# EAGLE design mouse_board (EAGLE 8.7.0)
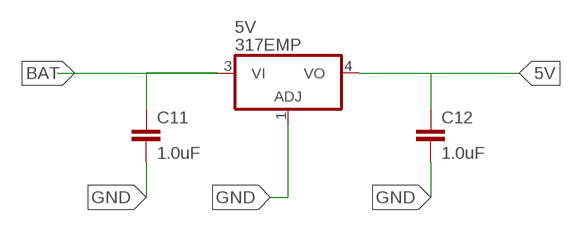
[diagram p0: schematic, sheet 1, part 1 of 2]
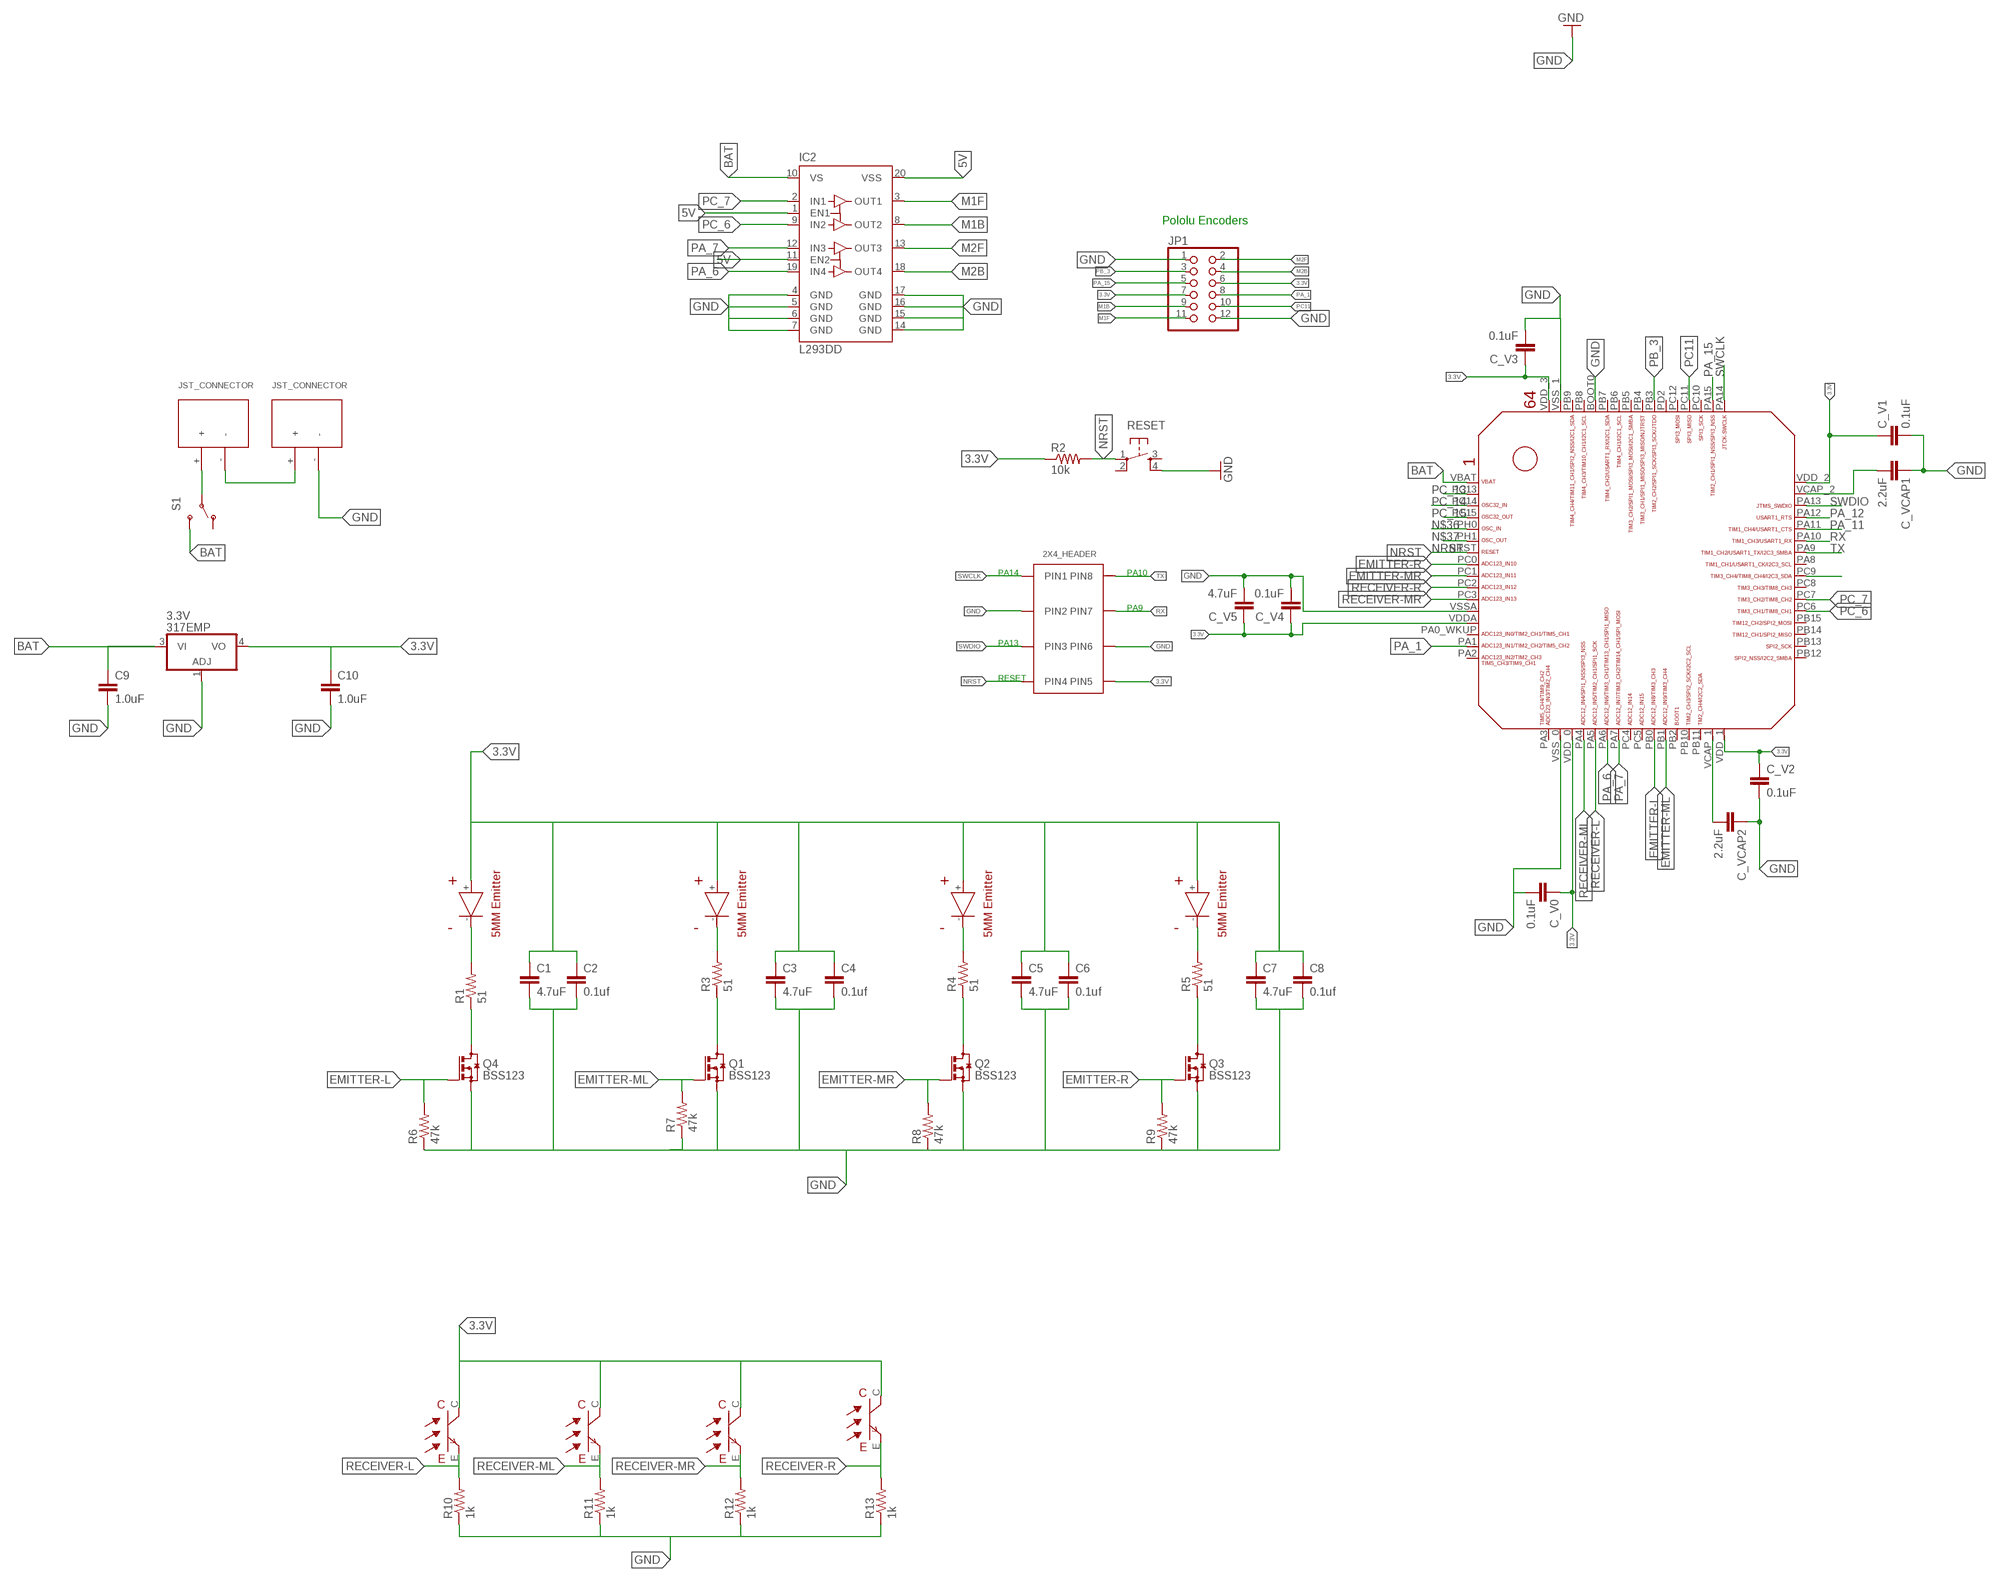
[diagram p1: schematic, sheet 1, part 2 of 2]

## Parts
3.3V  317EMP  [SOT223]
5V  317EMP  [SOT223]
BATTERY1  JST_CONNECTOR_FEMALE  [JST_CONNECTOR_FEMALE]
BATTERY2  JST_CONNECTOR_FEMALE  [JST_CONNECTOR_FEMALE]
C1  4.7uF  CAP0603-CAP  [0603-CAP]
C2  0.1uf  CAP0603-CAP  [0603-CAP]
C3  4.7uF  CAP0603-CAP  [0603-CAP]
C4  0.1uf  CAP0603-CAP  [0603-CAP]
C5  4.7uF  CAP0603-CAP  [0603-CAP]
C6  0.1uf  CAP0603-CAP  [0603-CAP]
C7  4.7uF  CAP0603-CAP  [0603-CAP]
C8  0.1uf  CAP0603-CAP  [0603-CAP]
C9  1.0uF  CAP0603-CAP  [0603-CAP]
C10  1.0uF  CAP0603-CAP  [0603-CAP]
C11  1.0uF  CAP0603-CAP  [0603-CAP]
C12  1.0uF  CAP0603-CAP  [0603-CAP]
C_V0  0.1uF  CAP0603-CAP  [0603-CAP]
C_V1  0.1uF  CAP0603-CAP  [0603-CAP]
C_V2  0.1uF  CAP0603-CAP  [0603-CAP]
C_V3  0.1uF  CAP0603-CAP  [0603-CAP]
C_V4  0.1uF  CAP0603-CAP  [0603-CAP]
C_V5  4.7uF  CAP0603-CAP  [0603-CAP]
C_VCAP1  2.2uF  CAP0603-CAP  [0603-CAP]
C_VCAP2  2.2uF  CAP0603-CAP  [0603-CAP]
IC2  L293DD  [SO20]
JP1  PINHD-2X6  [2X06]
MCU/BLU  2X3_HEADER  [2X3_HEADER]
Q1  BSS123  [SOT23]
Q2  BSS123  [SOT23]
Q3  BSS123  [SOT23]
Q4  BSS123  [SOT23]
R1  51  RESISTOR0603  [0603-RES]
R2  10k  RESISTOR0603  [0603-RES]
R3  51  RESISTOR0603  [0603-RES]
R4  51  RESISTOR0603  [0603-RES]
R5  51  RESISTOR0603  [0603-RES]
R6  47k  RESISTOR0603  [0603-RES]
R7  47k  RESISTOR0603  [0603-RES]
R8  47k  RESISTOR0603  [0603-RES]
R9  47k  RESISTOR0603  [0603-RES]
R10  1k  RESISTOR0603  [0603-RES]
R11  1k  RESISTOR0603  [0603-RES]
R12  1k  RESISTOR0603  [0603-RES]
R13  1k  RESISTOR0603  [0603-RES]
RESET  TAC_SWITCHPTH  [TACTILE-PTH]
S1  SWITCH-SPST-SMD-A  [SWITCH-SPST-SMD-A]
U$1  STM32F405/415_LQFP64  [STM32F405/415_LQFP64]
U$2  EMITTER  [EMITTER]
U$3  EMITTER  [EMITTER]
U$4  EMITTER  [EMITTER]
U$5  EMITTER  [EMITTER]
U$6  RECEIVER  [RECEIVER]
U$7  RECEIVER  [RECEIVER]
U$8  RECEIVER  [RECEIVER]
U$9  RECEIVER  [RECEIVER]

## Nets
3.3V: 3.3V.4(VO) C1.1 C2.1 C7.1 C8.1 C10.1 C_V0.1 C_V1.1 C_V2.1 C_V3.1 C_V4.1 C_V5.1 JP1.6 JP1.7 MCU/BLU.PIN5 R2.1 U$1.VDD_0 U$1.VDD_1 U$1.VDD_2 U$1.VDD_3 U$1.VDDA U$2.+ U$3.+ U$4.+ U$5.+ U$6.C U$7.C U$8.C U$9.C
3.3V1: Q4.3(D) R1.1
3.3V2: Q1.3(D) R3.1
3.3V4: Q3.3(D) R5.1
5V: 5V.4(VO) C12.1 IC2.1(EN1) IC2.11(EN2) IC2.20(VSS)
5V1: C3.1 C4.1
5V2: C5.1 C6.1
BAT: 3.3V.3(VI) 5V.3(VI) C9.1 C11.1 IC2.10(VS) S1.3(S) U$1.VBAT
EMITTER-L: Q4.1(G) R6.2 U$1.PB0
EMITTER-L2: R11.2 U$7.E
EMITTER-L3: R12.2 U$8.E
EMITTER-L4: R13.2 U$9.E
EMITTER-ML: Q1.1(G) R7.2 U$1.PB1
EMITTER-MR: Q2.1(G) R8.2 U$1.PC1
EMITTER-R: Q3.1(G) R9.2 U$1.PC0
GND: 3.3V.1(ADJ) 5V.1(ADJ) BATTERY2.- C1.2 C2.2 C3.2 C4.2 C5.2 C6.2 C7.2 C8.2 C9.2 C10.2 C11.2 C12.2 C_V0.2 C_V1.2 C_V2.2 C_V3.2 C_V4.2 C_V5.2 C_VCAP1.1 C_VCAP2.1 IC2.4(GND) IC2.5(GND) IC2.6(GND) IC2.7(GND) IC2.14(GND) IC2.15(GND) IC2.16(GND) IC2.17(GND) JP1.1 JP1.12 MCU/BLU.PIN2 MCU/BLU.PIN6 Q1.2(S) Q2.2(S) Q3.2(S) Q4.2(S) R6.1 R7.1 R8.1 R9.1 R10.1 R11.1 R12.1 R13.1 RESET.4 U$1.BOOT0 U$1.VSS_0 U$1.VSS_1 U$1.VSSA
M1B: IC2.8(OUT2) JP1.9
M1F: IC2.3(OUT1) JP1.11
M2B: IC2.18(OUT4) JP1.4
M2F: IC2.13(OUT3) JP1.2 U$1.PC9
N$2: R1.2 U$5.-
N$3: R3.2 U$4.-
N$4: R4.2 U$3.-
N$5: R5.2 U$2.-
N$6: Q2.3(D) R4.1
N$8: BATTERY1.- BATTERY2.+
N$9: BATTERY1.+ S1.2(P)
N$36: U$1.PH0
N$37: U$1.PH1
NRST: MCU/BLU.PIN4 R2.2 RESET.1 U$1.NRST
PA_1: JP1.8 U$1.PA1
PA_6: IC2.19(IN4) U$1.PA6
PA_7: IC2.12(IN3) U$1.PA7
PA_11: U$1.PA11
PA_12: U$1.PA12
PA_15: JP1.5 U$1.PA15
PB_3: JP1.3 U$1.PB3
PC11: JP1.10 U$1.PC11
PC_6: IC2.9(IN2) U$1.PC6
PC_7: IC2.2(IN1) U$1.PC7
PC_13: U$1.PC13
PC_14: U$1.PC14
PC_15: U$1.PC15
RECEIVER-L: R10.2 U$1.PA5 U$6.E
RECEIVER-ML: U$1.PA4
RECEIVER-MR: U$1.PC3
RECEIVER-R: U$1.PC2
RX: MCU/BLU.PIN7 U$1.PA10
SWCLK: MCU/BLU.PIN1 U$1.PA14
SWDIO: MCU/BLU.PIN3 U$1.PA13
TX: MCU/BLU.PIN8 U$1.PA9
V_C1: C_VCAP1.2 U$1.VCAP_2
V_C2: C_VCAP2.2 U$1.VCAP_1
Unconnected: RESET.2 RESET.3 S1.1(O) U$1.PA0_WKUP(PA0_AKUP) U$1.PA2 U$1.PA3 U$1.PA8 U$1.PB2 U$1.PB4 U$1.PB5 U$1.PB6 U$1.PB7 U$1.PB8 U$1.PB9 U$1.PB10 U$1.PB11 U$1.PB12 U$1.PB13 U$1.PB14 U$1.PB15 U$1.PC4 U$1.PC5 U$1.PC8 U$1.PC10 U$1.PC12 U$1.PD2

## Notes on the sheet
- Pololu Encoders
- PA14 | PA10
- PA9
- PA13
- RESET

## Library data of the parts
3.3V 5V = linear:*317: Positive VOLTAGE REGULATOR; SPICEPREFIX: J
BATTERY1 BATTERY2 = JST_CONNECTOR_FEMALE. through hole:JST_CONNECTOR_FEMALE
C1-C8 C_V0 C_V1-C_V5 C_VCAP1 C_VCAP2 = SparkFun:CAP: Capacitor Standard 0603 ceramic capacitor, and 0.1" leaded capacitor.
C9-C12 = SparkFun-Capacitors:CAP: Capacitor Standard 0603 ceramic capacitor, and 0.1" leaded capacitor.
IC2 = st-microelectronics:L293DD: PUSH-PULL FOUR CHANNEL DRIVER WITH DIODES Source: http://www.st.com/stonline/books/pdf/docs/1330.pdf; OC_FARNELL: unknown
JP1 = pinhead:PINHD-2X6: PIN HEADER
MCU/BLU = 2X4_HEADER:2X3_HEADER
Q1-Q4 = transistor-small-signal:BSS123: N-CHANNEL MOS FET
R1-R13 = SparkFun-Resistors:RESISTOR: Resistor Basic schematic elements and footprints for 0603, 1206, and PTH resistors.
RESET = SparkFun:TAC_SWITCH: Momentary Switch Button commonly used for reset or general input. Spark Fun Electronics SKU : COM-00097
S1 = SparkFun:SWITCH-SPST: SPST Switch Simple slide switch. Spark Fun Electronics SKU : COM-00102
U$1 = STM32F10x-F4xx:STM32F405/415_LQFP64
U$2-U$5 = sfh4550 _ teft4300:EMITTER
U$6-U$9 = sfh4550 _ teft4300:RECEIVER

## Board
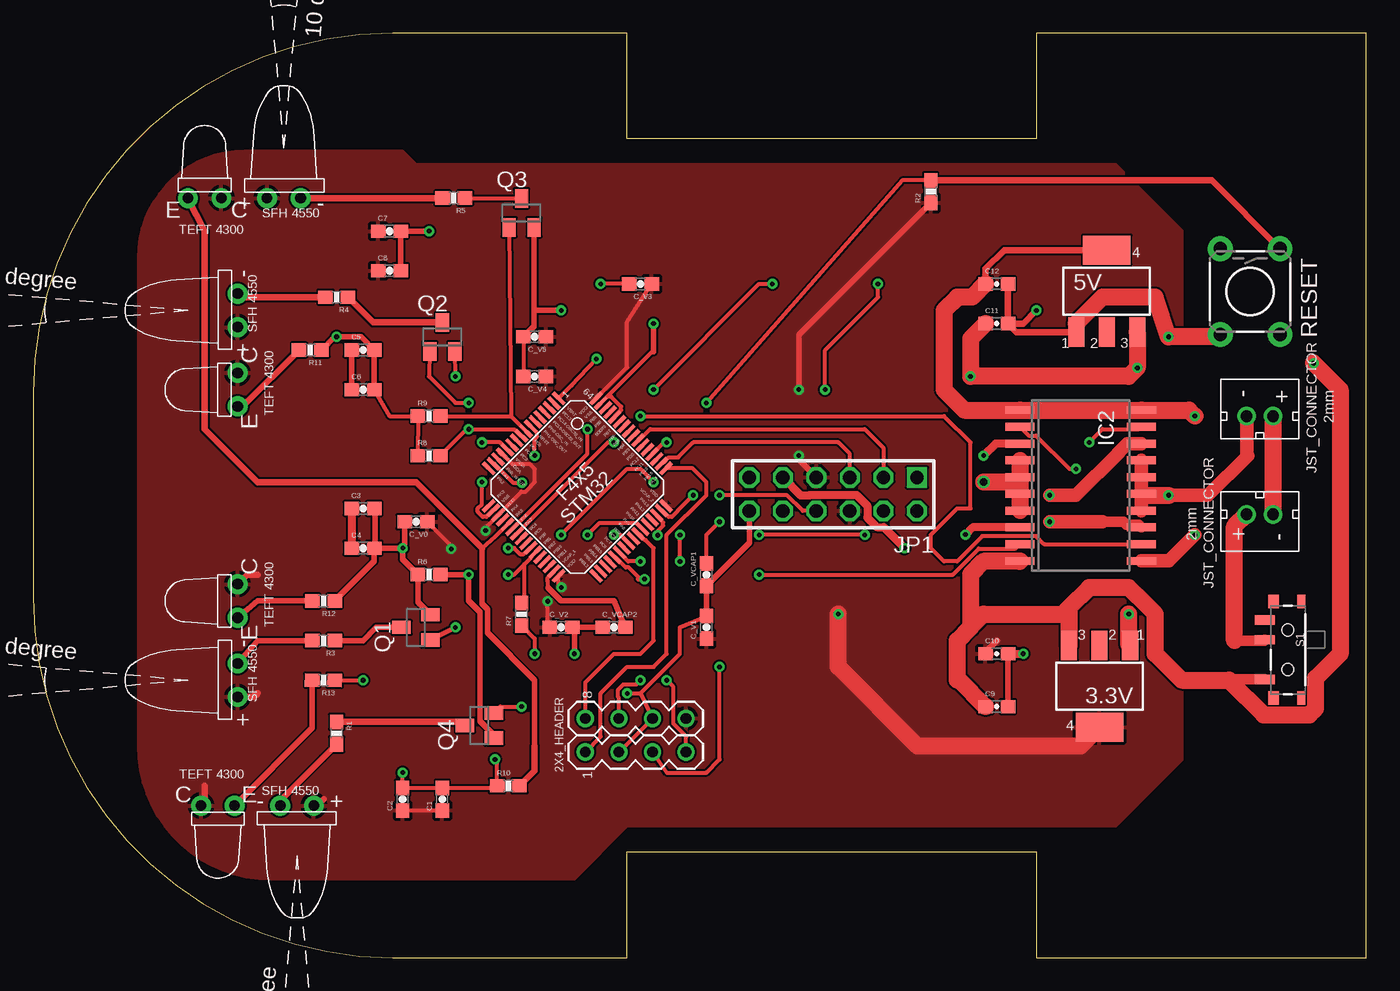
[diagram p2: board, top side]
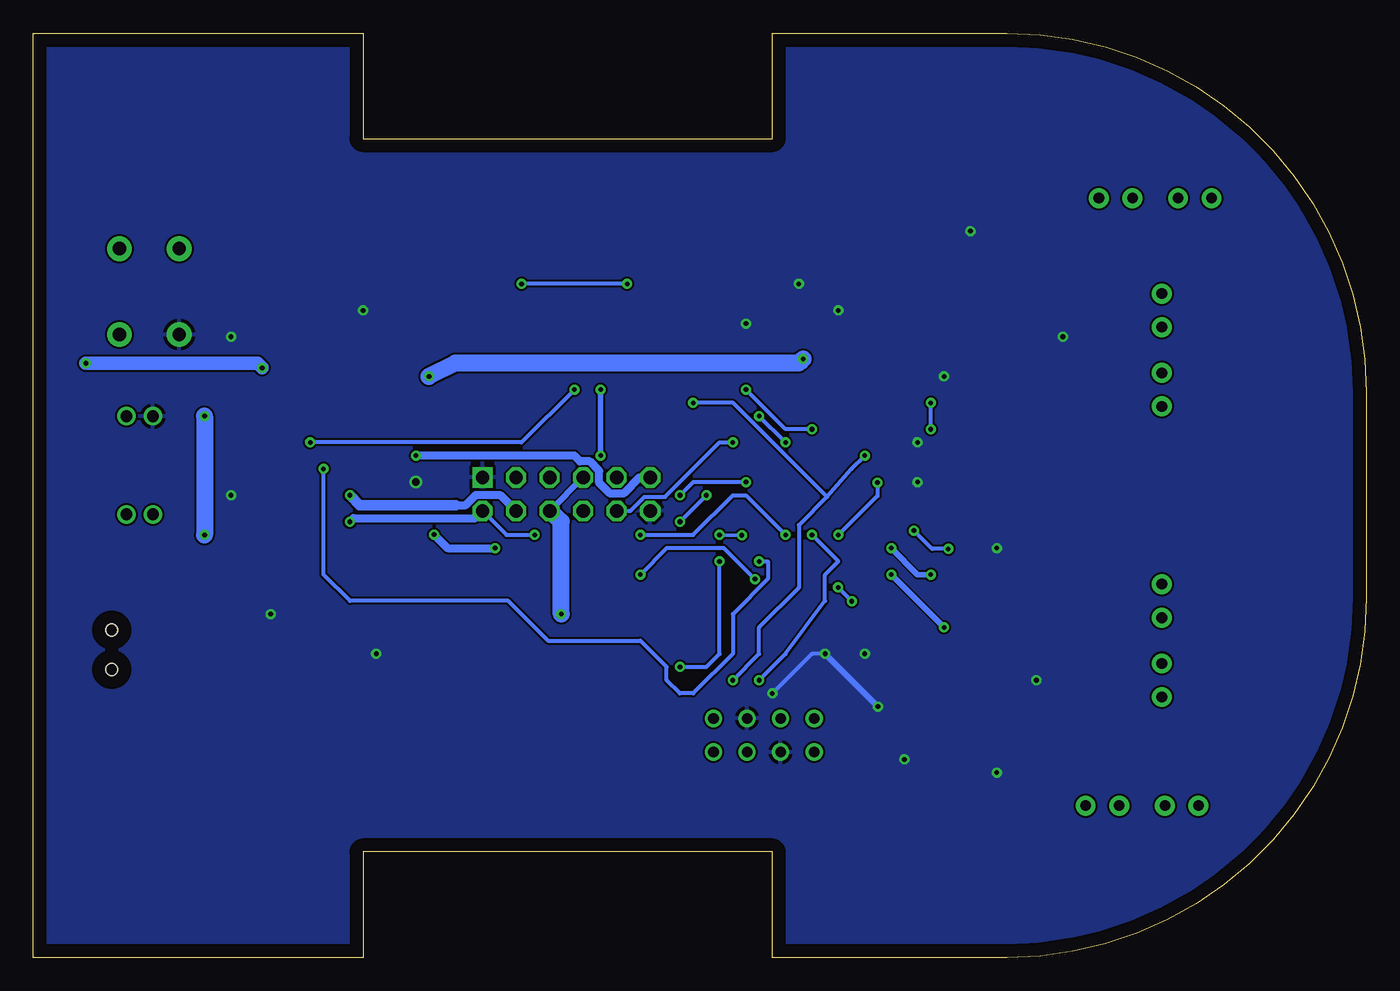
[diagram p3: board, bottom side, seen from below]

Size 101 x 70 mm. Coordinates in mm from the lower left corner, seen from the top.
Outline: 101,0 101,70 76,70 76,62 45,62 45,70 27.23,70 arc90 0,42.77 0,27.23 arc90 27.23,0 45,0 45,8 76,8 76,0 101,0
Copper layers (1*16): Top 0.035mm / dielectric 1.5mm / Bottom 0.035mm
Design rules "default": minimum track width 6mil, minimum drill 0.35mm, track to track 6mil, track to pad 6mil, pad to pad 6mil, via to via 6mil, smd to smd 6mil, copper to edge 40mil, drill to drill 6mil, minimum pad ring 10mil, minimum via ring 8mil, stop-mask expansion 4mil, vias tented up to drill 0mil, thermal gap 10mil

### Footprints (pad centres in the part's own frame; a part is rotated, then mirrored left to right if it is on the bottom)
SOT223 = smd 1.219 x 2.235: 1 -2.311,-3.099; 2 0,-3.099; 3 2.311,-3.099 | smd 3.6 x 2.2: 4 0,3.099
JST_CONNECTOR_FEMALE = drill 0.889: + 0,1; - 0,-1
0603-CAP = smd 1.1 x 1: 1 -0.85,0; 2 0.85,0
SO20 = smd 0.6 x 2.2: 1 -5.715,-4.6; 2 -4.445,-4.6; 3 -3.175,-4.6; 4 -1.905,-4.6; 5 -0.635,-4.6; 6 0.635,-4.6; 7 1.905,-4.6; 8 3.175,-4.6; 9 4.445,-4.6; 10 5.715,-4.6; 11 5.715,4.6; 12 4.445,4.6; 13 3.175,4.6; 14 1.905,4.6; 15 0.635,4.6; 16 -0.635,4.6; 17 -1.905,4.6; 18 -3.175,4.6; 19 -4.445,4.6; 20 -5.715,4.6
2X06 = drill 1.016 square: 1 -6.35,-1.27 | drill 1.016 octagon: 2 -6.35,1.27; 3 -3.81,-1.27; 4 -3.81,1.27; 5 -1.27,-1.27; 6 -1.27,1.27; 7 1.27,-1.27; 8 1.27,1.27; 9 3.81,-1.27; 10 3.81,1.27; 11 6.35,-1.27; 12 6.35,1.27
2X3_HEADER = drill 0.8: PIN1 -1.27,3.81; PIN2 -1.27,1.27; PIN3 -1.27,-1.27; PIN4 -1.27,-3.81; PIN5 1.27,-3.81; PIN6 1.27,-1.27; PIN7 1.27,1.27; PIN8 1.27,3.81
SOT23 = smd 1 x 1.4: 1 -0.95,-1.1; 2 0.95,-1.1; 3 0,1.1
0603-RES = smd 1.1 x 1: 1 -0.85,0; 2 0.85,0
TACTILE-PTH = drill 1.016 pad 1.88: 1 -3.251,2.261; 2 3.251,2.261; 3 -3.251,-2.261; 4 3.251,-2.261
SWITCH-SPST-SMD-A = smd 0.7 x 1.5: 1 -2.25,-1.75; 2 -0.75,-1.75; 3 2.25,-1.75 | smd 1 x 0.6: GND1 -3.65,1; GND3 3.65,1 | smd 1 x 0.8: GND2 -3.65,-1.1; GND4 3.65,-1.1 | hole 0.9: -1.5,0; 1.5,0
STM32F405/415_LQFP64 = smd 1.2 x 0.3: BOOT0 -5.75,-1.75; PA3 5.75,-3.75; PA4 5.75,-2.25; PA5 5.75,-1.75; PA6 5.75,-1.25; PA7 5.75,-0.75; PA14 -5.75,3.75; PA15 -5.75,3.25; PB0 5.75,0.75; PB1 5.75,1.25; PB2 5.75,1.75; PB3 -5.75,0.75; PB4 -5.75,0.25; PB5 -5.75,-0.25; PB6 -5.75,-0.75; PB7 -5.75,-1.25; PB8 -5.75,-2.25; PB9 -5.75,-2.75; PB10 5.75,2.25; PB11 5.75,2.75; PC4 5.75,-0.25; PC5 5.75,0.25; PC10 -5.75,2.75; PC11 -5.75,2.25; PC12 -5.75,1.75; PD2 -5.75,1.25; VCAP_1 5.75,3.25; VDD_0 5.75,-2.75; VDD_1 5.75,3.75; VDD_3 -5.75,-3.75; VSS_0 5.75,-3.25; VSS_1 -5.75,-3.25 | smd 0.3 x 1.2: NRST -0.75,-5.75; PA0_WKUP 2.75,-5.75; PA1 3.25,-5.75; PA2 3.75,-5.75; PA8 -0.25,5.75; PA9 -0.75,5.75; PA10 -1.25,5.75; PA11 -1.75,5.75; PA12 -2.25,5.75; PA13 -2.75,5.75; PB12 3.75,5.75; PB13 3.25,5.75; PB14 2.75,5.75; PB15 2.25,5.75; PC0 -0.25,-5.75; PC1 0.25,-5.75; PC2 0.75,-5.75; PC3 1.25,-5.75; PC6 1.75,5.75; PC7 1.25,5.75; PC8 0.75,5.75; PC9 0.25,5.75; PC13 -3.25,-5.75; PC14 -2.75,-5.75; PC15 -2.25,-5.75; PH0 -1.75,-5.75; PH1 -1.25,-5.75; VBAT -3.75,-5.75; VCAP_2 -3.25,5.75; VDD_2 -3.75,5.75; VDDA 2.25,-5.75; VSSA 1.75,-5.75
EMITTER = drill 0.8 pad 1.5: + -1.27,-0.5; - 1.27,-0.5
RECEIVER = drill 0.8 pad 1.5: C 1.27,-0.5; E -1.27,-0.5

### Placement (x,y rotation side)
3.3V  80.78,20.54 180 top
5V  81.33,50.46 0 top
BATTERY1  92.92,33.56 90 top
BATTERY2  92.92,40.99 270 top
C1  31,12 90 top
C2  28,12 90 top
C3  25,34 0 top
C4  25,31 0 top
C5  25,46 0 top
C6  25,43 0 top
C7  27,55 0 top
C8  27,52 0 top
C9  73,19 0 top
C10  73,23 0 top
C11  73,48 0 top
C12  73,51 0 top
C_V0  29,33 180 top
C_V1  51,25 90 top
C_V2  40,25 0 top
C_V3  46,51 180 top
C_V4  38,44 180 top
C_V5  38,47 180 top
C_VCAP1  51,29 90 top
C_VCAP2  44,25 0 top
IC2  79.35,35.74 270 top
JP1  60.6,35.08 180 top
MCU/BLU  45.65,16.83 90 top
Q1  29,25 90 top
Q2  31,47 0 top
Q3  37,56.38 0 top
Q4  33.81,17.57 90 top
R1  23,17 270 top
R2  68,58 90 top
R3  22,24 180 top
R4  23,50 180 top
R5  31.87,57.51 180 top
R6  30,29 0 top
R7  37,26 90 top
R8  30,38 0 top
R9  30,41 0 top
R10  36,13 0 top
R11  21,46 180 top
R12  22,27 180 top
R13  22,21 179.1 top
RESET  92.19,50.42 270 top
S1  95.05,23.3 270 top
U$1  41.23,35.62 225 top
U$2  19,58 0 top
U$3  15,49 90 top
U$4  15,21 90 top
U$5  20,11 180 top
U$6  13,58 0 top
U$7  15,43 90 top
U$8  15,27 90 top
U$9  14,11 180 top

### Tracks (layer width: path | path; a pad name or v marks a point on that pad's centre or on a via)
3.3V  (via drill 0.35)
  Top 0.305: C2.1 C1.1 | 35.3,38.3 35.51,38.09 U$1.VDDA 36.33,37.33 37.67,37.33 38,37 38,36 37.72,35.72 37.72,35.68 37.32,35.28 37,35.28 U$1.VDD_0 34.27,32.55 v34.27,32.32 | C_V2.1 38.98,25.17 v38.98,26.98 | v40.02,28.02 39.82,28.22 U$1.VDD_1 | U$1.VDD_3 45,44.69 45,48.15 C_V3.1 | C_V0.1 31.68,31.17 v31.68,30.95
  Top 0.406: JP1.7 58,37.68 v58,38 | 68,57 R2.1 58,47.15 v58,43
  Top 0.508: U$5.+ 21.5,11.5 22,12 | U$9.C 13,11.77 13,13 | U$4.+ 16.73,19.73 17,20 | U$8.C 16.23,29 17,29 | C10.1 72.15,23.15 73,24
  Top 1.27: 3.3V.4 79.34,16 67,16 61,22 v61,26
  Bottom 0.305: v38.98,26.98 v40.02,28.02 | v31.68,30.95 32.9,30.95 v34.27,32.32
  Bottom 0.406: v58,43 v58,38 | JP1.7 61.84,33.84 JP1.6
  Bottom 1.27: v61,26 61,33 61.84,33.84
  pour Top: 28,61 16,61 arc90 8,53 8,16 arc90 18,6 24,6 41,6 45,10 82,10 87,15 87,55 82,60 29,60
3.3V1
  Top 0.508: R1.1 32.43,17.85 Q4.3
3.3V2
  Top 0.406: R3.1 25,24 26,25 Q1.3
3.3V4
  Top 0.305: R5.1 Q3.3
5V  (via drill 0.35)
  Top 0.508: 5V.4 73.56,53.56 72.15,52.15 C12.1
  Top 1.016: IC2.11 86.03,30.02 v88,32
  Top 1.27: C12.1 71.15,50 70,50 69,49 69,43 70.55,41.45 IC2.1 IC2.20 87.55,41.45 v88,41
  Bottom 1.27: v88,41 v88,32
5V1
  Top 0.61: C3.1 C4.1
5V2
  Top 0.406: C5.1 C6.1
BAT  (via drill 0.35)
  Top 0.305: U$1.VBAT 40.81,43.33 v42.67,45.33
  Top 0.813: S1.3 90.64,21.05
  Top 1.016: 97.05,21.05 99,23 | 90.64,21.05 90.59,21
  Top 1.27: 78.47,26.47 3.3V.3 | 78.47,26.47 80,28 83,28 83.58,27.42 83.59,27.42 85,26.01 85,23 87,21 90.59,21 93.22,18.37 96.67,18.37 97.15,18.84 97.15,21.15 99,23 99,43 v97,45 | 5V.3 v83.64,44.64 83,44 v71,44 71,46.85 C11.1 | C9.1 70.15,21 70,21 70,24 71,25 | 71,25 72,26 78,26 78.47,26.47 | IC2.10 74.72,30 72,30 71,29 71,25
  Bottom 1.016: v97,45 84,45 v83.64,44.64
  Bottom 1.27: v71,44 69,45 43,45 v42.67,45.33
EMITTER-L  (via drill 0.35)
  Top 0.305: v36,31 36.44,31 36.9,30.54 37.15,30.54 37.63,31.02 U$1.PB0
  Top 0.406: Q4.1 34.91,16.82 33.85,17.87 33.85,26.15 33,27 v33,29 R6.2
  Bottom 0.406: v36,31 34,29 v33,29
EMITTER-L2
  Top 0.508: R11.2 15.88,41.73 U$7.E
EMITTER-L3
  Top 0.406: U$8.E 17,27 R12.2
EMITTER-L4
  Top 0.406: U$9.E 21.15,17.38 R13.2
EMITTER-ML  (via drill 0.35)
  Top 0.305: v36,29 36.44,29 37.22,29.78 | 37.22,29.78 37.72,30.28 37.72,30.34 U$1.PB1 | R7.2 37.22,27.07 37.22,29.78
  Top 0.406: v32,25 Q1.1
  Bottom 0.406: v36,29 v32,25
EMITTER-MR  (via drill 0.35)
  Top 0.305: Q2.1 30,44 32,42 v33,42 | v33,40 v33.01,39.99 | U$1.PC1 36.92,39.51 36.44,39.99 v33.01,39.99 | R8.2 32.84,39.99 v33.01,39.99
  Bottom 0.305: v33,40 v33,42
EMITTER-R
  Top 0.305: R9.2 36.2,41 | 36.2,41 U$1.PC0 | Q3.1 36.2,41
GND  (via drill 0.35, 0.55 pad 0.65)
  Top 0.152: IC2.5 74.75,35
  Top 0.305: RESET.4 89.76,47 | 34.85,33.85 U$1.VSS_0 34.8,33.85 34.32,33.37 34.07,33.37 33.68,33.76 33.68,34.01 34,34.34 v34,36 | 25.93,30.92 C4.2 | R13.1 24.99,20.99 v25,21 | R10.1 35,12.85 C1.2 C2.2 v28,14 | R10.1 35,13.15 | R10.1 35.15,14.85 v35,15 | Q4.2 35.39,19 v37,19 | 74.64,35 IC2.6 74.75,35 | C_V5.2 C_V4.2 | R8.1 29.15,37.98 R9.1 27,41 C6.2 | v32,44 Q2.2 | MCU/BLU.PIN2 MCU/BLU.PIN6 | MCU/BLU.PIN6 | v45,20 46,20 | 46,20 MCU/BLU.PIN6 | 46,20 49,23 49,25 C_V1.2 | U$1.VSSA 35.38,39 v34,39 | R7.1 38,24.15 v38,23 | C_V3.2 v43,51 | 47,45.87 46.88,45.87 43.51,42.49 | U$1.VSS_1 43.51,42.49 | U$1.BOOT0 44.06,40.99 44.54,41.47 44.54,41.72 43.8,42.47 43.53,42.47 43.51,42.49 | IC2.15 84.06,35
  Top 0.406: C3.2 25.93,33.92 25.93,30.92 | R12.1 25.85,30 C4.2 v28,31 | v28,31 28.15,31 C_V0.2 | 30.15,26 Q1.2 29.15,26.9 R6.1 28,30.15 v28,31 | Q3.2 37.95,49 | 37.95,49 37.95,47.8 C_V5.2 | C8.2 C7.2 v30,55 | 47,45.87 v47,48 | C6.2 C5.2 24.85,47 v23,47 22.85,47 R11.1 | v41,23 41,24.85 C_V2.2 C_VCAP2.1 | C_V1.2 C_VCAP1.1 54.25,31.4 JP1.12 | C9.2 C10.2 | 37.95,49 v40,49
  Top 0.508: C11.2 C12.2 | v76,49 75,48 C11.2 | 5V.1 74.49,47.36 C11.2
  Top 0.61: C10.2 v75,23
  Top 1.016: IC2.17 IC2.16 IC2.15 IC2.14 | v86,35 89,35 92,38 91.92,38.08 BATTERY2.-
  Top 1.27: 89.76,47 v86,47 85,50 81,50 79,48 | IC2.4 74.75,36 | 74.75,36 74.75,35 IC2.7 | 74.75,36 v72,36 | 3.3V.1 83,23.73 v83,26 | 84.06,35 v86,35
  Bottom 0.305: v41,23 42,23 v45,20
  Bottom 0.406: v37,19 v41,23
  pour Bottom: 98,74 18,74 -2,54 -2,16 19,-5 98,-5 104,1 104,68
M1B  (via drill 0.35)
  Top 0.61: IC2.8 71.16,32.56 v70.62,32.02 | JP1.9 58.14,35 58.8,35 58.83,35.03 62.38,35.03 63.19,34.21 63.19,33.3 63.91,32.59 64.44,32.59 66,31.03 v66,31
  Bottom 0.61: v70.62,32.02 69.6,31 v66,31
M1F  (via drill 0.35)
  Top 0.61: IC2.3 72.92,38.91 v72,38
  Bottom 0.61: JP1.11 55.07,36.35 56.28,35.13 57.3,35.13 58.11,35.95 58.11,36.85 58.83,37.57 59.57,37.57 60,38 v72,38
M2B  (via drill 0.35)
  Top 0.305: IC2.18 83.8,38.77 83.24,38.77
  Top 1.016: IC2.18 82.89,38.91 82.19,38.22 82.19,38.19 79,35 v77,35
  Bottom 0.61: 68.98,34.26 68.23,34.26 67.45,35.03 65.63,35.03 JP1.4
  Bottom 0.813: v77,35 76.26,34.26 68.98,34.26
M2F  (via drill 0.35)
  Top 0.305: v63,32 v55,32 | v44,32 44.5,32 U$1.PC9
  Top 0.813: IC2.13 83.75,32.77 82.83,32.77 82.59,33 81,33
  Top 1.016: 81,33 v77,33
  Bottom 0.305: JP1.2 65.14,32 v63,32 | v55,32 51,32 48,35 47,35 v44,32
  Bottom 0.61: v77,33 76.73,33.27 67.49,33.27 JP1.2
N$2
  Top 0.406: U$5.- 18.73,11.88 21.93,15.07 R1.2
N$3
  Top 0.406: U$4.- 17,24 R3.2
N$4
  Top 0.508: U$3.- 15.77,50 R4.2
N$5
  Top 0.508: U$2.- R5.2
N$6
  Top 0.508: R4.1 25.75,48.1 Q2.3
N$8
  Top 1.27: BATTERY2.+ BATTERY1.-
N$9
  Top 0.813: S1.2 93.24,24 91,24
  Top 1.27: 91,24 91,32.64 BATTERY1.+
NRST  (via drill 0.35)
  Top 0.305: MCU/BLU.PIN4 49.46,16.74 48.5,17.7 48.5,20.5 v48,21 | R2.2 65.85,58.85 v51,42 | v38,38 38,39.24 38.18,39.42 38.18,39.73 U$1.NRST
  Top 0.508: R2.2 89.27,58.85 RESET.1
  Bottom 0.305: v48,21 46,23 46,25 43,28 43,32.73 40.86,34.88 | 40.86,34.88 39,37 v38,38 | 40.86,34.88 47.98,42 v51,42
PA_1  (via drill 0.35)
  Top 0.305: U$1.PA1 34.93,37.39 36.36,35.96 v37.04,35.96 | v40,32 45,37 46,37 v47,36 | JP1.8 58.3,33.81 57.11,35 v52,35
  Bottom 0.305: v40,32 37.04,34.96 v37.04,35.96 | v47,36 51,36 v52,35
PA_6  (via drill 0.35)
  Top 0.305: U$1.PA6 42,38.16 v42,40 | v60,43 60,46 64,50 v64,51 | v80,39 81,40 83.77,40 IC2.19 | v47,43 55,51 v56,51
  Bottom 0.305: v56,51 v64,51 | v60,43 64,39 v80,39 | v42,40 44,40 v47,43
PA_7  (via drill 0.35)
  Top 0.305: IC2.12 76.58,31.3 75.98,31.9 71.9,31.9 70,30 69,30 68,31 68,32 70,34 71,34 71,39 69,41 v46,41 | U$1.PA7 43.55,39 v44,39
  Bottom 0.305: v44,39 v46,41
PA_15
  Top 0.305: U$1.PA15 47.79,37.52 48.14,37.87 48.87,37.87 50,39 61,39 61.87,38.13 JP1.5
PB_3
  Top 0.305: U$1.PB3 45.89,39.16 46.73,40 63,40 64.41,38.59 JP1.3
PC11  (via drill 0.35)
  Top 0.305: v48,39 47.79,39 U$1.PC11
  Bottom 0.305: JP1.10 55.76,33.81 54.69,34.88 53.12,34.88 49,39 v48,39
PC_6  (via drill 0.35)
  Top 0.305: 45.79,28.65 46,28.65 | 46,28.65 v46.32,28.65 | IC2.9 74.42,30.97 71.64,30.97 69.67,29 v55,29 | 46,28.65 45.11,29.54 44.89,29.54 44.12,30.32 U$1.PC6
  Bottom 0.305: v46.32,28.65 48.67,31 53,31 v55,29
PC_7  (via drill 0.35)
  Top 0.305: IC2.2 75.42,39.52 75.98,39.52 78.5,37 v79,37 | v46,30 45.09,30 45.04,30.04 | 45.04,30.04 U$1.PC7 | U$1.PC7 45.04,30.04
  Bottom 0.305: v46,30 45.34,30 45.34,28.66 48,26 48,23 51,20 52,20 53,21 53,22 55,24 62,24 65,27 77,27 79,29 v79,37
RECEIVER-L
  Top 0.305: U$1.PA5 35,31.87 34,31
  Top 0.406: 38,16 38,21 34.41,24.59 34.41,26.38 34,26.79 34,31
  Top 0.508: U$6.E 13,55 13,40 17,36 29,36 34,31 | R10.2 38,14.15 38,16
RX  (via drill 0.35)
  Top 0.305: MCU/BLU.PIN7 44.38,19.65 44.32,19.72 44.32,20.28 44.72,20.68 45.68,20.68 v46,21 | v42,32 42.92,32.92 45.7,32.92 U$1.PA10
  Bottom 0.305: v46,21 44,23 41,27 41,29 40,30 v42,32
SWCLK
  Top 0.305: MCU/BLU.PIN1 43,16.72 43,20 45,22 47,22 48,23 48,32 51,35 51,36 49.97,37.03 U$1.PA14
SWDIO  (via drill 0.35)
  Top 0.305: MCU/BLU.PIN3 48,14 51,14 52,15 v52,22 | v49,30 v49,32 | U$1.PA13 47.24,33.44 47.72,32.95 47.72,32.7 47.32,32.3 v47.32,31.98
  Bottom 0.305: v52,22 50,22 49,23 v49,30 | v49,32 v47.32,31.98
TX
  Top 0.305: MCU/BLU.PIN8 41.84,20.84 44,23 46,23 47,24 47,31 46.4,31.6 46.37,31.6 45.89,32.08 U$1.PA9
V_C1  (via drill 0.35)
  Top 0.305: C_VCAP1.2 51,32 v52,33 | U$1.VCAP_2 47.66,33.85 48.14,33.37 48.39,33.37 48.78,33.76 48.78,33.78 v50,35
  Bottom 0.305: v52,33 v50,35
V_C2
  Top 0.305: 39,28 39,28.44 38.98,28.46 38.98,28.77 U$1.VCAP_1
  Top 0.406: C_VCAP2.2 44,27 | 44,27 | 44,27 | 44,27 40,27 39,28